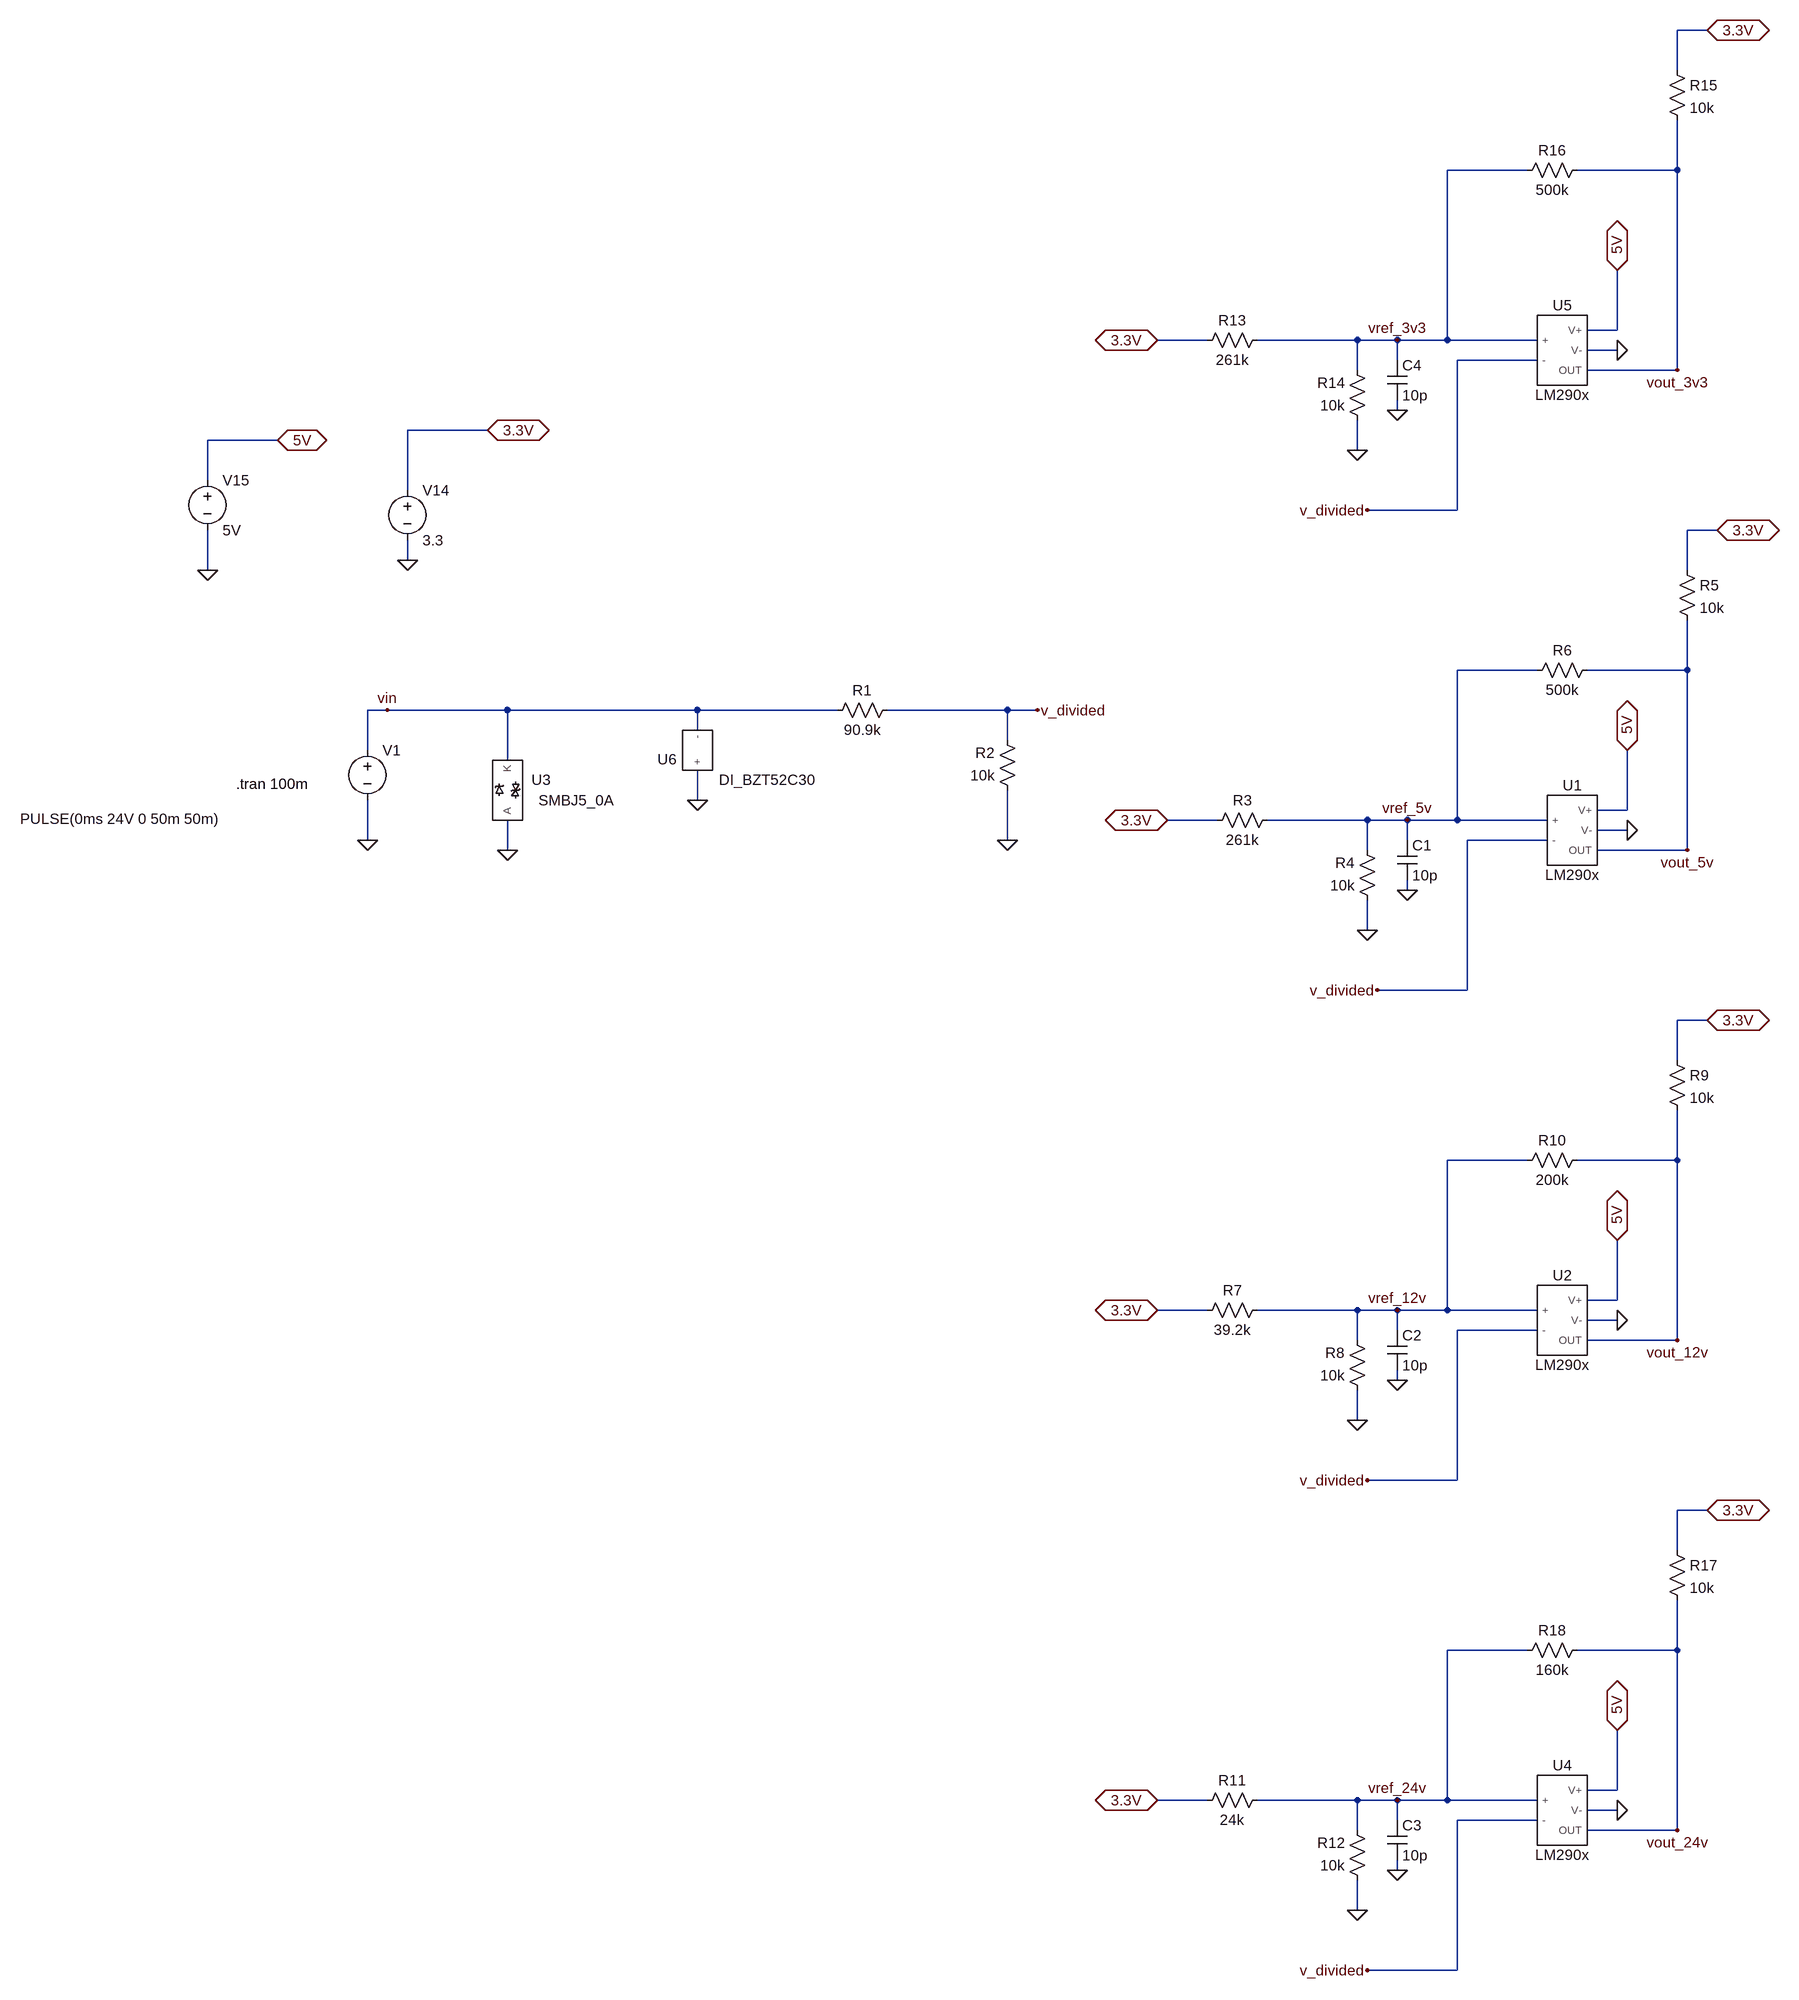
[diagram p0: schematic DigitalInputCallum.asc]
DigitalInputCallum.asc, the LTspice schematic file:
Version 4
SHEET 1 3068 2908
WIRE 1216 -496 1168 -496
WIRE 1168 -432 1168 -496
WIRE 928 -272 800 -272
WIRE 1168 -272 1168 -352
WIRE 1168 -272 1008 -272
WIRE 1072 -16 1072 -112
WIRE 1072 -16 1024 -16
WIRE 416 0 336 0
WIRE 656 0 496 0
WIRE 720 0 656 0
WIRE 800 0 800 -272
WIRE 800 0 720 0
WIRE 944 0 800 0
WIRE 1072 16 1024 16
WIRE 720 32 720 0
WIRE 944 32 816 32
WIRE 656 48 656 0
WIRE 1168 48 1168 -272
WIRE 1168 48 1024 48
WIRE 720 112 720 96
WIRE -736 144 -864 144
WIRE -1072 160 -1184 160
WIRE 656 176 656 128
WIRE -1184 224 -1184 160
WIRE -864 240 -864 144
WIRE 816 272 816 32
WIRE 816 272 672 272
WIRE 1232 304 1184 304
WIRE -864 352 -864 320
WIRE -1184 368 -1184 304
WIRE 1184 368 1184 304
WIRE 944 528 816 528
WIRE 1184 528 1184 448
WIRE 1184 528 1024 528
WIRE -896 592 -928 592
WIRE -704 592 -896 592
WIRE -400 592 -704 592
WIRE -176 592 -400 592
WIRE 96 592 -96 592
WIRE 144 592 96 592
WIRE -400 624 -400 592
WIRE 96 640 96 592
WIRE -928 656 -928 592
WIRE -704 672 -704 592
WIRE -400 736 -400 688
WIRE 1088 752 1088 656
WIRE 1088 752 1040 752
WIRE 432 768 352 768
WIRE 672 768 512 768
WIRE 736 768 672 768
WIRE 816 768 816 528
WIRE 816 768 736 768
WIRE 960 768 816 768
WIRE 1088 784 1040 784
WIRE -928 800 -928 736
WIRE 96 800 96 720
WIRE 736 800 736 768
WIRE 960 800 832 800
WIRE -704 816 -704 768
WIRE 672 816 672 768
WIRE 1184 816 1184 528
WIRE 1184 816 1040 816
WIRE 736 880 736 864
WIRE 672 944 672 896
WIRE 832 1040 832 800
WIRE 832 1040 688 1040
WIRE 1216 1088 1168 1088
WIRE 1168 1152 1168 1088
WIRE 928 1312 800 1312
WIRE 1168 1312 1168 1232
WIRE 1168 1312 1008 1312
WIRE 1072 1536 1072 1440
WIRE 1072 1536 1024 1536
WIRE 416 1552 336 1552
WIRE 656 1552 496 1552
WIRE 720 1552 656 1552
WIRE 800 1552 800 1312
WIRE 800 1552 720 1552
WIRE 944 1552 800 1552
WIRE 1072 1568 1024 1568
WIRE 720 1584 720 1552
WIRE 944 1584 816 1584
WIRE 656 1600 656 1552
WIRE 1168 1600 1168 1312
WIRE 1168 1600 1024 1600
WIRE 720 1664 720 1648
WIRE 656 1728 656 1680
WIRE 816 1824 816 1584
WIRE 816 1824 672 1824
WIRE 1216 1872 1168 1872
WIRE 1168 1936 1168 1872
WIRE 928 2096 800 2096
WIRE 1168 2096 1168 2016
WIRE 1168 2096 1008 2096
WIRE 1072 2320 1072 2224
WIRE 1072 2320 1024 2320
WIRE 416 2336 336 2336
WIRE 656 2336 496 2336
WIRE 720 2336 656 2336
WIRE 800 2336 800 2096
WIRE 800 2336 720 2336
WIRE 944 2336 800 2336
WIRE 1072 2352 1024 2352
WIRE 720 2368 720 2336
WIRE 944 2368 816 2368
WIRE 656 2384 656 2336
WIRE 1168 2384 1168 2096
WIRE 1168 2384 1024 2384
WIRE 720 2448 720 2432
WIRE 656 2512 656 2464
WIRE 816 2608 816 2368
WIRE 816 2608 672 2608
FLAG 96 800 0
FLAG -928 800 0
FLAG -864 352 0
FLAG -1184 368 0
FLAG -1072 160 5V
IOPIN -1072 160 BiDir
FLAG -736 144 3.3V
IOPIN -736 144 BiDir
FLAG 144 592 v_divided
FLAG -896 592 vin
FLAG -704 816 0
FLAG -400 736 0
FLAG 656 176 0
FLAG 1216 -496 3.3V
IOPIN 1216 -496 BiDir
FLAG 336 0 3.3V
IOPIN 336 0 BiDir
FLAG 1072 -112 5V
IOPIN 1072 -112 BiDir
FLAG 1072 16 0
FLAG 672 272 v_divided
FLAG 1168 48 vout_3v3
FLAG 720 0 vref_3v3
FLAG 720 112 0
FLAG 672 944 0
FLAG 1232 304 3.3V
IOPIN 1232 304 BiDir
FLAG 352 768 3.3V
IOPIN 352 768 BiDir
FLAG 1088 656 5V
IOPIN 1088 656 BiDir
FLAG 1088 784 0
FLAG 688 1040 v_divided
FLAG 1184 816 vout_5v
FLAG 736 768 vref_5v
FLAG 736 880 0
FLAG 656 1728 0
FLAG 1216 1088 3.3V
IOPIN 1216 1088 BiDir
FLAG 336 1552 3.3V
IOPIN 336 1552 BiDir
FLAG 1072 1440 5V
IOPIN 1072 1440 BiDir
FLAG 1072 1568 0
FLAG 672 1824 v_divided
FLAG 1168 1600 vout_12v
FLAG 720 1552 vref_12v
FLAG 720 1664 0
FLAG 656 2512 0
FLAG 1216 1872 3.3V
IOPIN 1216 1872 BiDir
FLAG 336 2336 3.3V
IOPIN 336 2336 BiDir
FLAG 1072 2224 5V
IOPIN 1072 2224 BiDir
FLAG 1072 2352 0
FLAG 672 2608 v_divided
FLAG 1168 2384 vout_24v
FLAG 720 2336 vref_24v
FLAG 720 2448 0
SYMBOL res -80 576 R90
WINDOW 0 0 56 VBottom 2
WINDOW 3 32 56 VTop 2
SYMATTR InstName R1
SYMATTR Value 90.9k
SYMBOL res 112 736 R180
WINDOW 0 36 76 Left 2
WINDOW 3 36 40 Left 2
SYMATTR InstName R2
SYMATTR Value 10k
SYMBOL voltage -928 640 R0
WINDOW 3 -556 126 Left 2
WINDOW 123 0 0 Left 0
WINDOW 39 0 0 Left 0
SYMATTR InstName V1
SYMATTR Value PULSE(0ms 24V 0 50m 50m)
SYMBOL voltage -864 224 R0
WINDOW 123 0 0 Left 0
WINDOW 39 0 0 Left 0
SYMATTR InstName V14
SYMATTR Value 3.3
SYMBOL voltage -1184 208 R0
WINDOW 123 0 0 Left 0
WINDOW 39 0 0 Left 0
SYMATTR InstName V15
SYMATTR Value 5V
SYMBOL smbj_thermal_05-07-25_lt -704 720 R270
WINDOW 0 1 54 VTop 2
WINDOW 38 -1 110 VBottom 2
SYMATTR InstName U3
SYMBOL DI_BZT52C30 -400 656 R270
WINDOW 0 -30 -48 VTop 2
WINDOW 3 -63 112 VTop 2
SYMATTR InstName U6
SYMBOL res 512 -16 R90
WINDOW 0 0 56 VBottom 2
WINDOW 3 32 56 VTop 2
SYMATTR InstName R13
SYMATTR Value 261k
SYMBOL res 672 144 R180
WINDOW 0 36 76 Left 2
WINDOW 3 36 40 Left 2
SYMATTR InstName R14
SYMATTR Value 10k
SYMBOL res 1152 -448 R0
SYMATTR InstName R15
SYMATTR Value 10k
SYMBOL res 1024 -288 R90
WINDOW 0 0 56 VBottom 2
WINDOW 3 32 56 VTop 2
SYMATTR InstName R16
SYMATTR Value 500k
SYMBOL LM290x 976 16 R0
SYMATTR InstName U5
SYMBOL cap 704 32 R0
SYMATTR InstName C4
SYMATTR Value 10p
SYMBOL res 528 752 R90
WINDOW 0 0 56 VBottom 2
WINDOW 3 32 56 VTop 2
SYMATTR InstName R3
SYMATTR Value 261k
SYMBOL res 688 912 R180
WINDOW 0 36 76 Left 2
WINDOW 3 36 40 Left 2
SYMATTR InstName R4
SYMATTR Value 10k
SYMBOL res 1168 352 R0
SYMATTR InstName R5
SYMATTR Value 10k
SYMBOL res 1040 512 R90
WINDOW 0 0 56 VBottom 2
WINDOW 3 32 56 VTop 2
SYMATTR InstName R6
SYMATTR Value 500k
SYMBOL LM290x 992 784 R0
SYMATTR InstName U1
SYMBOL cap 720 800 R0
SYMATTR InstName C1
SYMATTR Value 10p
SYMBOL res 512 1536 R90
WINDOW 0 0 56 VBottom 2
WINDOW 3 32 56 VTop 2
SYMATTR InstName R7
SYMATTR Value 39.2k
SYMBOL res 672 1696 R180
WINDOW 0 36 76 Left 2
WINDOW 3 36 40 Left 2
SYMATTR InstName R8
SYMATTR Value 10k
SYMBOL res 1152 1136 R0
SYMATTR InstName R9
SYMATTR Value 10k
SYMBOL res 1024 1296 R90
WINDOW 0 0 56 VBottom 2
WINDOW 3 32 56 VTop 2
SYMATTR InstName R10
SYMATTR Value 200k
SYMBOL LM290x 976 1568 R0
SYMATTR InstName U2
SYMBOL cap 704 1584 R0
SYMATTR InstName C2
SYMATTR Value 10p
SYMBOL res 512 2320 R90
WINDOW 0 0 56 VBottom 2
WINDOW 3 32 56 VTop 2
SYMATTR InstName R11
SYMATTR Value 24k
SYMBOL res 672 2480 R180
WINDOW 0 36 76 Left 2
WINDOW 3 36 40 Left 2
SYMATTR InstName R12
SYMATTR Value 10k
SYMBOL res 1152 1920 R0
SYMATTR InstName R17
SYMATTR Value 10k
SYMBOL res 1024 2080 R90
WINDOW 0 0 56 VBottom 2
WINDOW 3 32 56 VTop 2
SYMATTR InstName R18
SYMATTR Value 160k
SYMBOL LM290x 976 2352 R0
SYMATTR InstName U4
SYMBOL cap 704 2368 R0
SYMATTR InstName C3
SYMATTR Value 10p
TEXT -1138 710 Left 2 !.tran 100m

The netlist it stands for:
* DigitalInputCallum.asc
R1 v_divided vin 90.9k
R2 0 v_divided 10k
V1 vin 0 PULSE(0ms 24V 0 50m 50m)
V14 3.3V 0 3.3
V15 5V 0 5V
XU3 0 vin SMBJ5_0A  ; pins A K
XU6 0 vin DI_BZT52C30  ; pins + -
R13 vref_3v3 3.3V 261k
R14 0 vref_3v3 10k
R15 3.3V vout_3v3 10k
R16 vout_3v3 vref_3v3 500k
XU5 vref_3v3 v_divided 5V 0 vout_3v3 LM290x  ; pins + - V+ V- OUT
C4 vref_3v3 0 10p
R3 vref_5v 3.3V 261k
R4 0 vref_5v 10k
R5 3.3V vout_5v 10k
R6 vout_5v vref_5v 500k
XU1 vref_5v v_divided 5V 0 vout_5v LM290x  ; pins + - V+ V- OUT
C1 vref_5v 0 10p
R7 vref_12v 3.3V 39.2k
R8 0 vref_12v 10k
R9 3.3V vout_12v 10k
R10 vout_12v vref_12v 200k
XU2 vref_12v v_divided 5V 0 vout_12v LM290x  ; pins + - V+ V- OUT
C2 vref_12v 0 10p
R11 vref_24v 3.3V 24k
R12 0 vref_24v 10k
R17 3.3V vout_24v 10k
R18 vout_24v vref_24v 160k
XU4 vref_24v v_divided 5V 0 vout_24v LM290x  ; pins + - V+ V- OUT
C3 vref_24v 0 10p
.tran 100m
.lib smbj_thermal_05-07-25_LT_encrypted.lib
.lib BZT52C30.lib
.lib lm290x.lib
.backanno
.end